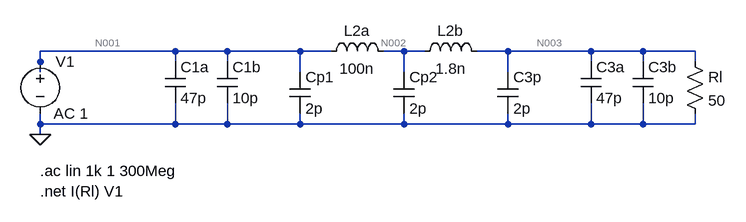
[diagram p0: schematic real.asc]
real.asc, the LTspice schematic file:
Version 4
SHEET 1 1828 680
WIRE 624 128 416 128
WIRE 704 128 624 128
WIRE 816 128 704 128
WIRE 864 128 816 128
WIRE 976 128 944 128
WIRE 1008 128 976 128
WIRE 1136 128 1088 128
WIRE 1264 128 1136 128
WIRE 1344 128 1264 128
WIRE 1424 128 1344 128
WIRE 416 144 416 128
WIRE 624 144 624 128
WIRE 704 144 704 128
WIRE 1264 144 1264 128
WIRE 1344 144 1344 128
WIRE 1424 144 1424 128
WIRE 416 160 416 144
WIRE 816 160 816 128
WIRE 976 160 976 128
WIRE 1136 160 1136 128
WIRE 416 240 416 224
WIRE 624 240 624 208
WIRE 624 240 416 240
WIRE 704 240 704 208
WIRE 704 240 624 240
WIRE 816 240 816 224
WIRE 816 240 704 240
WIRE 976 240 976 224
WIRE 976 240 816 240
WIRE 1136 240 1136 224
WIRE 1136 240 976 240
WIRE 1264 240 1264 208
WIRE 1264 240 1136 240
WIRE 1344 240 1344 208
WIRE 1344 240 1264 240
WIRE 1424 240 1424 224
WIRE 1424 240 1344 240
WIRE 416 256 416 240
FLAG 416 256 0
SYMBOL Voltage 416 128 R0
WINDOW 3 24 96 Invisible 2
WINDOW 123 21 96 Left 2
SYMATTR Value ""
SYMATTR Value2 AC 1
SYMATTR InstName V1
SYMATTR SpiceLine Rser=50
SYMBOL Cap 608 144 R0
SYMATTR InstName C1a
SYMATTR Value 47p
SYMATTR SpiceLine Rser=0.08
SYMBOL Cap 1248 144 R0
SYMATTR InstName C3a
SYMATTR Value 47p
SYMATTR SpiceLine Rser=0.08
SYMBOL ind 848 144 R270
WINDOW 0 32 56 VTop 2
WINDOW 3 5 56 VBottom 2
SYMATTR InstName L2a
SYMATTR Value 100n
SYMATTR SpiceLine Rser=1.2
SYMBOL Res 1408 128 R0
SYMATTR InstName Rl
SYMATTR Value 50
SYMBOL ind 992 144 R270
WINDOW 0 32 56 VTop 2
WINDOW 3 5 56 VBottom 2
SYMATTR InstName L2b
SYMATTR Value 1.8n
SYMATTR SpiceLine Rser=0.12
SYMBOL Cap 688 144 R0
SYMATTR InstName C1b
SYMATTR Value 10p
SYMATTR SpiceLine Rser=0.4
SYMBOL Cap 1328 144 R0
SYMATTR InstName C3b
SYMATTR Value 10p
SYMATTR SpiceLine Rser=0.4
SYMBOL Cap 800 160 R0
SYMATTR InstName Cp1
SYMATTR Value 2p
SYMBOL Cap 960 160 R0
SYMATTR InstName Cp2
SYMATTR Value 2p
SYMBOL Cap 1120 160 R0
SYMATTR InstName C3p
SYMATTR Value 2p
TEXT 416 312 Left 2 !.ac lin 1k 1 300Meg
TEXT 416 344 Left 2 !.net I(Rl) V1

The netlist it stands for:
* real.asc
V1 N001 0 AC 1 Rser=50
C1a N001 0 47p Rser=0.08
C3a N003 0 47p Rser=0.08
L2a N001 N002 100n Rser=1.2
Rl N003 0 50
L2b N002 N003 1.8n Rser=0.12
C1b N001 0 10p Rser=0.4
C3b N003 0 10p Rser=0.4
Cp1 N001 0 2p
Cp2 N002 0 2p
C3p N003 0 2p
.ac lin 1k 1 300Meg
.net I(Rl) V1
.backanno
.end

* Results of the author's LTspice run, read from the files saved beside the schematic
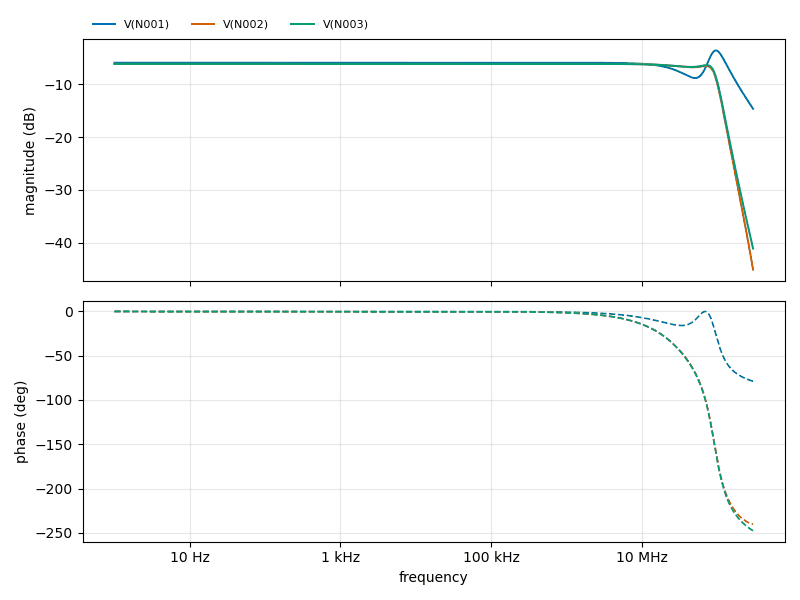
[diagram p1: AC Analysis of real.asc, plotted from the saved traces]
* AC Analysis, 1 run:
*   V(N001): -5.91 dB at 1 Hz, -14.63 dB at 300 MHz, peak -3.57 dB at 96.1 MHz, 3 dB below the peak at 71.39 MHz and 136.8 MHz
*   V(N002): -6.11 dB at 1 Hz, -45.14 dB at 300 MHz, peak -6.11 dB at 1 Hz, 3 dB below the peak at 97.18 MHz
*   V(N003): -6.13 dB at 1 Hz, -41.14 dB at 300 MHz, peak -6.13 dB at 1 Hz, 3 dB below the peak at 98.76 MHz